# Altium schematic sheet V1.0.SchDoc
size 127 x 55 mm
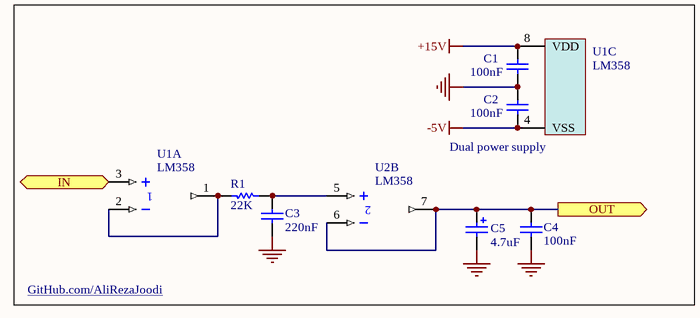
[diagram p0: V1.0.SchDoc]

## Parts
C1  100nF  [CAPNTO2.54-3.05x1.78A]
C2  100nF  [CAPNTO2.54-3.05x1.78A]
C3  220nF  [CAPNTO5.08-7.37x3.94]
C4  100nF  [CAPNTO2.54-3.05x1.78A]
C5  4.7uF  [CAPPR2.5-6.3x5]
R1  22K  [AXIAL-0.4]
U1  LM358  [751-02_L]  (parts A,C of 3)
U2  LM358  [751-02_L]  (part B of 3)

## Ports
IN (in), OUT (out)

## Nets
+15V: C1.2 U1.8(VDD)
-5V: C2.1 U1.4(VSS)
GND: C1.1 C2.2 C3.1 C4.1 C5.2
IN: U1.3(IN+) ; port IN
OUT: C4.2 C5.1 U2.6(IN-) U2.7(OUT) ; port OUT
NetC3_2: C3.2 R1.1 U2.5(IN+)
NetR1_2: R1.2 U1.1(OUT) U1.2(IN-)

## Notes on the sheet
- (near U1) Dual power supply
- GitHub.com/AliRezaJoodi

## Library data of the parts
C1 C2 C4 = Cap: Capacitor; Manufacturer: Generic Components; Class I: Passive; Published: 8-Jun-2000; Revision: July-2002: Re-released for DXP Platform.; Publisher: Altium Limited; Class II: Capacitor
C3 = Cap: Capacitor; Published: 8-Jun-2000; LatestRevisionDate: 17-Jul-2002; LatestRevisionNote: Re-released for DXP Platform.; PackageReference: RAD-0.3; Publisher: Altium Limited
C5 = Cap Pol1: Polarized Capacitor (Radial); Manufacturer: Generic Components; Class I: Passive; Published: 8-Jun-2000; Revision: July-2002: Re-released for DXP Platform.; Publisher: Altium Limited; Class II: Capacitor
R1 = Res1: Resistor; Published: 8-Jun-2000; LatestRevisionDate: 17-Jul-2002; LatestRevisionNote: Re-released for DXP Platform.; PackageReference: AXIAL-0.3; Publisher: Altium Limited
U1 U2 = LM358: Dual Low-Power Operational Amplifier; Published: 17-Jul-2002; LatestRevisionDate: 13-Apr-2006; LatestRevisionNote: IPC-7351 Footprint Added.; DatasheetVersion: 1988; PackageReference: 751-02; Publisher: Altium Limited; PackageDescription: 8-Pin Small Outline Integrated Circuit 1.27 mm Pitch; Code_JEDEC: MS-012-AA; Code_IPC: SOIC127P600-8; ComponentLink1Description: Manufacturer Link; ComponentLink1URL: http://www.onsemi.com/site/products/parametrics/0,4446,251,00.html; ComponentLink2Description: Datasheet; ComponentLink2URL: http://www.onsemi.com/pub/Collateral/LM358-D.PDF